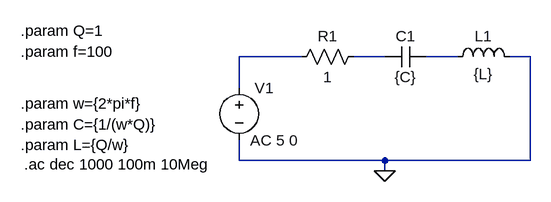
[diagram p0: schematic RLC serie.asc]
RLC serie.asc, the LTspice schematic file:
Version 4
SHEET 1 880 680
WIRE 160 96 64 96
WIRE 288 96 240 96
WIRE 400 96 352 96
WIRE 512 96 480 96
WIRE 64 144 64 96
WIRE 64 256 64 224
WIRE 288 256 64 256
WIRE 512 256 512 96
WIRE 512 256 288 256
WIRE 288 272 288 256
FLAG 288 272 0
SYMBOL voltage 64 128 R0
WINDOW 123 17 97 Left 2
WINDOW 39 0 0 Left 0
SYMATTR Value2 AC 5 0
SYMATTR InstName V1
SYMATTR Value ""
SYMBOL res 256 80 R90
WINDOW 0 0 56 VBottom 2
WINDOW 3 32 56 VTop 2
SYMATTR InstName R1
SYMATTR Value 1
SYMBOL cap 352 80 R90
WINDOW 0 0 32 VBottom 2
WINDOW 3 32 32 VTop 2
SYMATTR InstName C1
SYMATTR Value {C}
SYMBOL ind 384 112 R270
WINDOW 0 32 56 VTop 2
WINDOW 3 5 56 VBottom 2
SYMATTR InstName L1
SYMATTR Value {L}
TEXT -272 168 Left 2 !.param w={2*pi*f}
TEXT -272 56 Left 2 !.param Q=1
TEXT -272 200 Left 2 !.param C={1/(w*Q)}
TEXT -272 232 Left 2 !.param L={Q/w}
TEXT -272 88 Left 2 !.param f=100
TEXT -267 262 Left 2 !.ac dec 1000 100m 10Meg

The netlist it stands for:
* RLC serie.asc
V1 N001 0 AC 5 0
R1 N002 N001 1
C1 N003 N002 {C}
L1 N003 0 {L}
.param w={2*pi*f}
.param Q=1
.param C={1/(w*Q)}
.param L={Q/w}
.param f=100
.ac dec 1000 100m 10Meg
.backanno
.end